# EAGLE board csa_cpu_v2.0g (EAGLE 4.15)
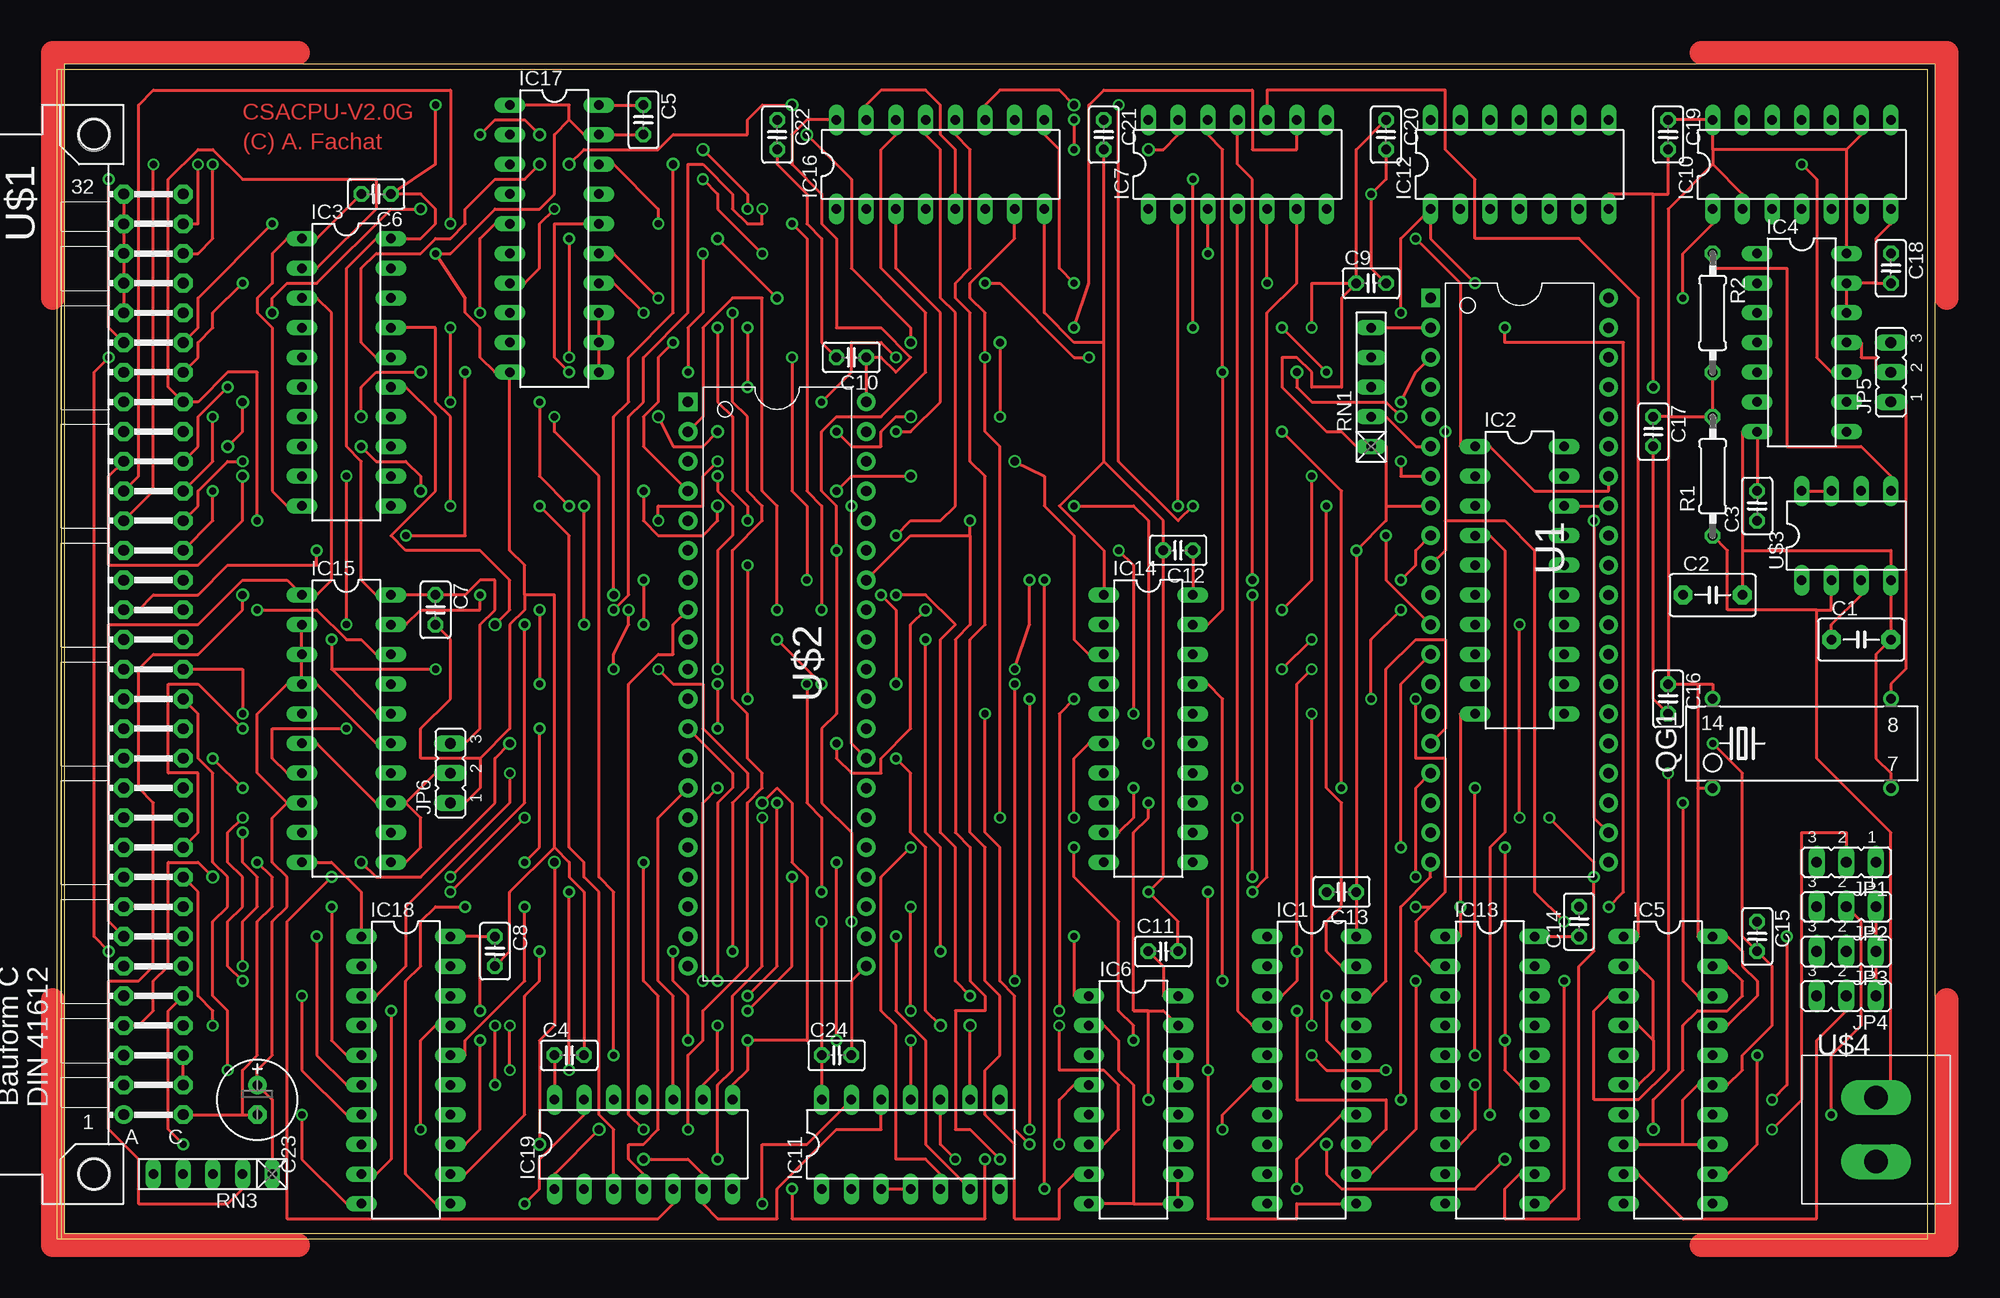
[diagram p2: board, top side]
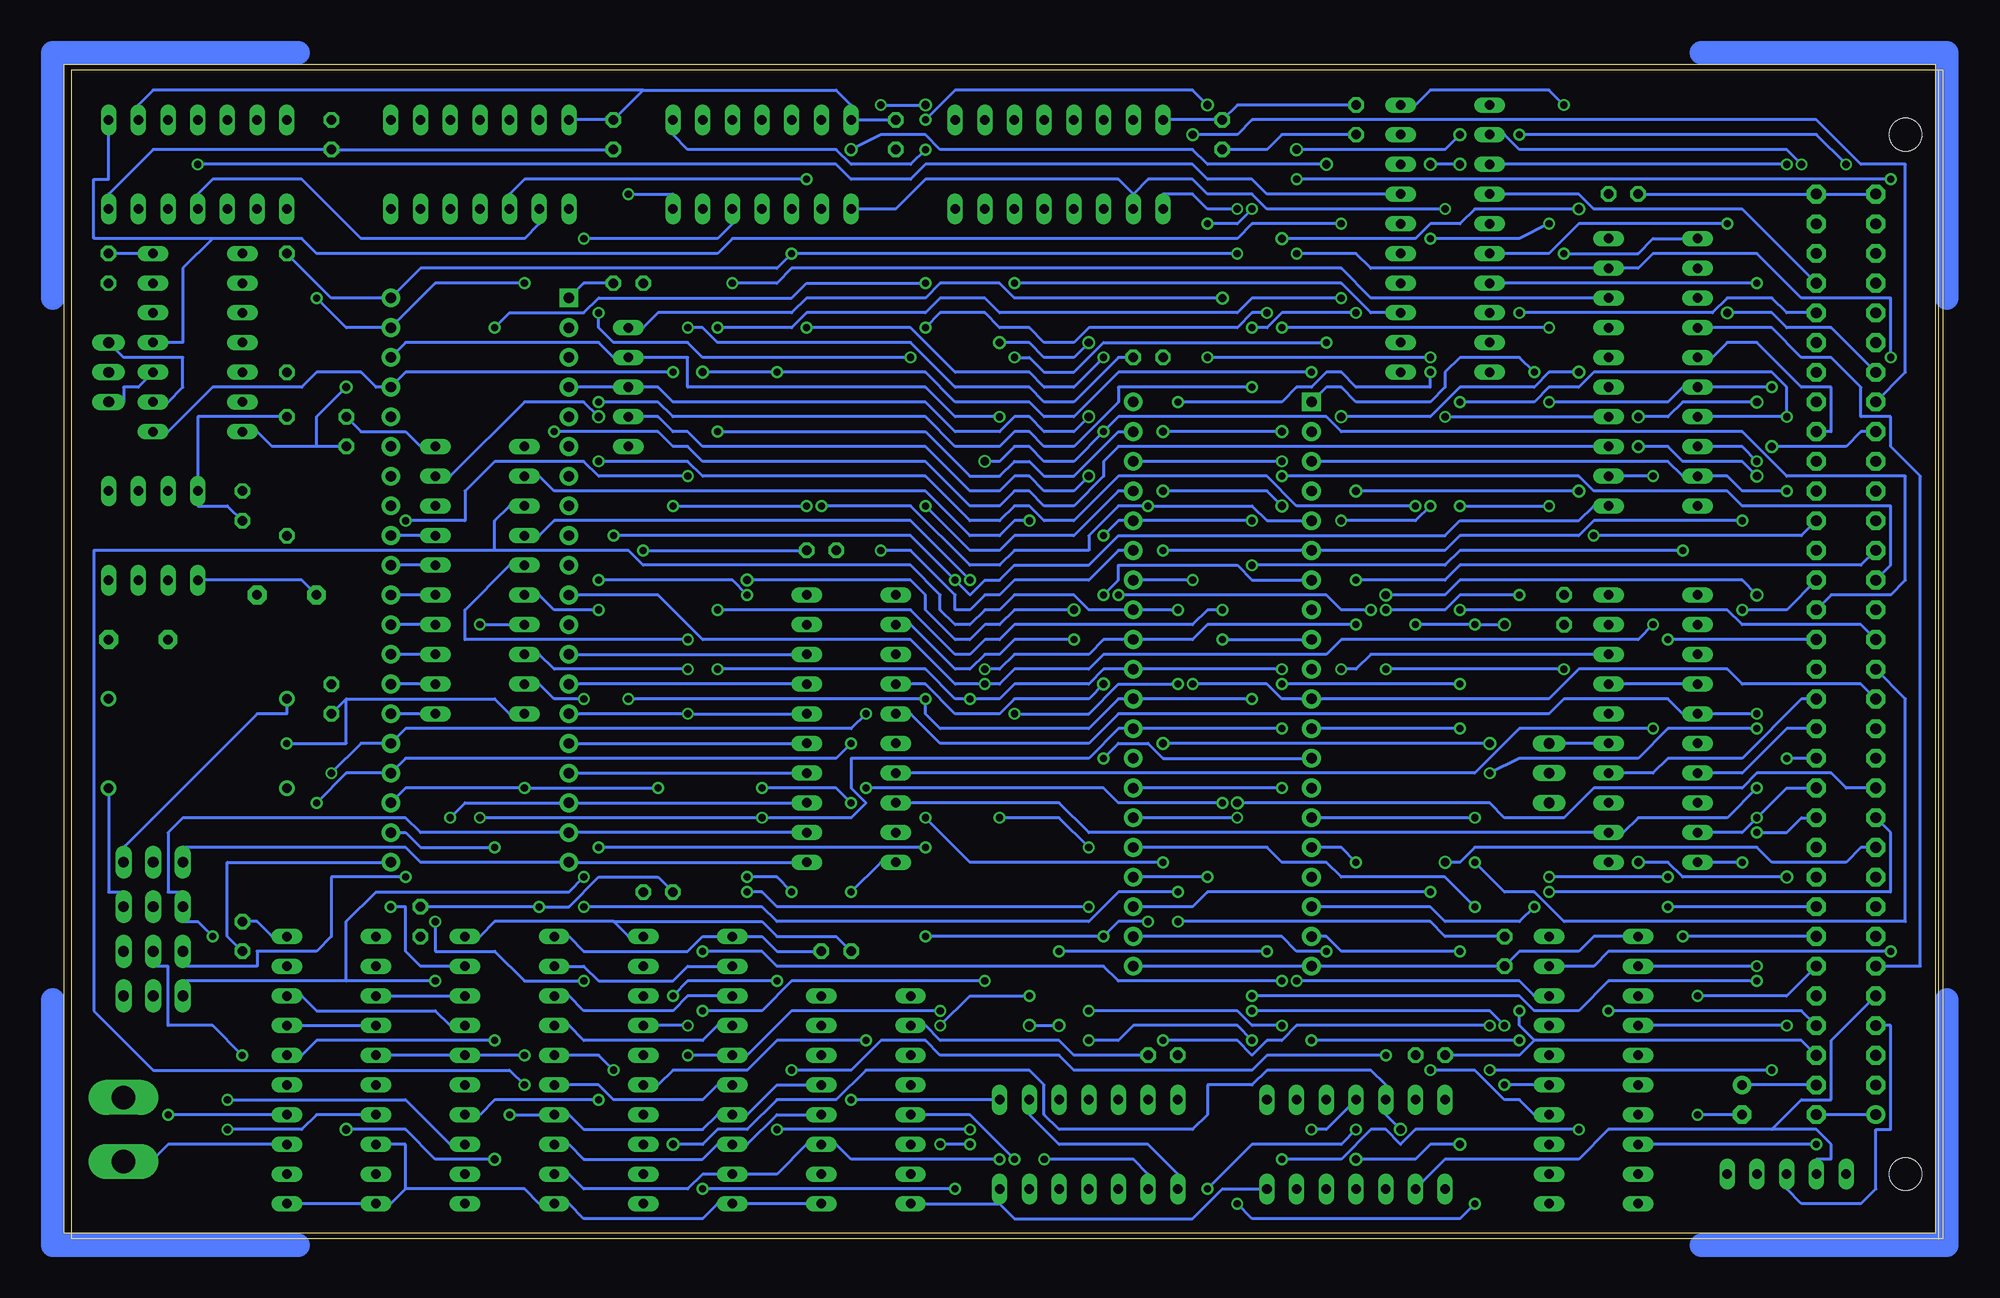
[diagram p3: board, bottom side, seen from below]

Size 160.63 x 100.48 mm. Coordinates in mm from the lower left corner, seen from the top.
Outline: 0,0.01 160,0.01 160,100.01 0,100.01 0,0.01
Outline: 0.63,0.48 160.63,0.48 160.63,100.48 0.63,100.48 0.63,0.48
Copper layers (1*16): Top 0.035mm / dielectric 1.5mm / Bottom 0.035mm
Design rules "default": minimum track width 10mil, minimum drill 24mil, track to track 8mil, track to pad 8mil, pad to pad 8mil, via to via 8mil, smd to smd 8mil, copper to edge 40mil, drill to drill 8mil, minimum pad ring 10mil, minimum via ring 8mil, stop-mask expansion 4mil, vias tented up to drill 0mil, thermal gap 10mil

## Footprints (pad centres in the part's own frame; a part is rotated, then mirrored left to right if it is on the bottom)
C5B3.5 = drill 0.813 pad 1.6 octagon: 1 -2.54,0; 2 2.54,0
C025-025X050 = drill 0.813 octagon: 1 -1.27,0; 2 1.27,0
E2,5-7 = drill 0.813 pad 1.6 round: + -1.27,0 | drill 0.813 pad 1.6 octagon: - 1.27,0
DIL20 = drill 0.813 long: 1 -11.43,-3.81; 2 -8.89,-3.81; 3 -6.35,-3.81; 4 -3.81,-3.81; 5 -1.27,-3.81; 6 1.27,-3.81; 7 3.81,-3.81; 8 6.35,-3.81; 9 8.89,-3.81; 10 11.43,-3.81; 11 11.43,3.81; 12 8.89,3.81; 13 6.35,3.81; 14 3.81,3.81; 15 1.27,3.81; 16 -1.27,3.81; 17 -3.81,3.81; 18 -6.35,3.81; 19 -8.89,3.81; 20 -11.43,3.81
DIL14 = drill 0.813 long: 1 -7.62,-3.81; 2 -5.08,-3.81; 3 -2.54,-3.81; 4 0,-3.81; 5 2.54,-3.81; 6 5.08,-3.81; 7 7.62,-3.81; 8 7.62,3.81; 9 5.08,3.81; 10 2.54,3.81; 11 0,3.81; 12 -2.54,3.81; 13 -5.08,3.81; 14 -7.62,3.81
DIL16 = drill 0.813 long: 1 -8.89,-3.81; 2 -6.35,-3.81; 3 -3.81,-3.81; 4 -1.27,-3.81; 5 1.27,-3.81; 6 3.81,-3.81; 7 6.35,-3.81; 8 8.89,-3.81; 9 8.89,3.81; 10 6.35,3.81; 11 3.81,3.81; 12 1.27,3.81; 13 -1.27,3.81; 14 -3.81,3.81; 15 -6.35,3.81; 16 -8.89,3.81
JP2 = drill 0.914 long: 1 -2.54,0; 2 0,0; 3 2.54,0
SG51 = drill 0.813 round: 1 -7.62,-3.81; 7 7.62,-3.81; 8 7.62,3.81; 14 -7.62,3.81
0207/10 = drill 0.813 octagon: 1 -5.08,0; 2 5.08,0
RN-5 = drill 0.813 long: 1 -5.08,0; 2 -2.54,0; 3 0,0; 4 2.54,0; 5 5.08,0
DIP-40 = drill 0.889 pad 1.6 square: 1 -22.86,-7.62 | drill 0.889 pad 1.6 round: 2 -20.32,-7.62; 3 -17.78,-7.62; 4 -15.24,-7.62; 5 -12.7,-7.62; 6 -10.16,-7.62; 7 -7.62,-7.62; 8 -5.08,-7.62; 9 -2.54,-7.62; 10 0,-7.62; 11 2.54,-7.62; 12 5.08,-7.62; 13 7.62,-7.62; 14 10.16,-7.62; 15 12.7,-7.62; 16 15.24,-7.62; 17 17.78,-7.62; 18 20.32,-7.62; 19 22.86,-7.62; 20 25.4,-7.62; 21 25.4,7.62; 22 22.86,7.62; 23 20.32,7.62; 24 17.78,7.62; 25 15.24,7.62; 26 12.7,7.62; 27 10.16,7.62; 28 7.62,7.62; 29 5.08,7.62; 30 2.54,7.62; 31 0,7.62; 32 -2.54,7.62; 33 -5.08,7.62; 34 -7.62,7.62; 35 -10.16,7.62; 36 -12.7,7.62; 37 -15.24,7.62; 38 -17.78,7.62; 39 -20.32,7.62; 40 -22.86,7.62
CSABUS = drill 0.914 pad 1.6 round: A1 7.62,36.83 | drill 0.914 pad 1.6 octagon: A2 7.62,34.29; A3 7.62,31.75; A4 7.62,29.21; A5 7.62,26.67; A6 7.62,24.13; A7 7.62,21.59; A8 7.62,19.05; A9 7.62,16.51; A10 7.62,13.97; A11 7.62,11.43; A12 7.62,8.89; A13 7.62,6.35; A14 7.62,3.81; A15 7.62,1.27; A16 7.62,-1.27; A17 7.62,-3.81; A18 7.62,-6.35; A19 7.62,-8.89; A20 7.62,-11.43; A21 7.62,-13.97; A22 7.62,-16.51; A23 7.62,-19.05; A24 7.62,-21.59; A25 7.62,-24.13; A26 7.62,-26.67; A27 7.62,-29.21; A28 7.62,-31.75; A29 7.62,-34.29; A30 7.62,-36.83; A31 7.62,-39.37; A32 7.62,-41.91; C1 2.54,36.83; C2 2.54,34.29; C3 2.54,31.75; C4 2.54,29.21; C5 2.54,26.67; C6 2.54,24.13; C7 2.54,21.59; C8 2.54,19.05; C9 2.54,16.51; C10 2.54,13.97; C11 2.54,11.43; C12 2.54,8.89; C13 2.54,6.35; C14 2.54,3.81; C15 2.54,1.27; C16 2.54,-1.27; C17 2.54,-3.81; C18 2.54,-6.35; C19 2.54,-8.89; C20 2.54,-11.43; C21 2.54,-13.97; C22 2.54,-16.51; C23 2.54,-19.05; C24 2.54,-21.59; C25 2.54,-24.13; C26 2.54,-26.67; C27 2.54,-29.21; C28 2.54,-31.75; C29 2.54,-34.29; C30 2.54,-36.83; C31 2.54,-39.37; C32 2.54,-41.91 | hole 2.794: 10.16,41.91; 10.16,-46.99
DIP40 = drill 0.889 pad 1.6 square: 1 -24.13,-7.62 | drill 0.889 pad 1.6 round: 2 -21.59,-7.62; 3 -19.05,-7.62; 4 -16.51,-7.62; 5 -13.97,-7.62; 6 -11.43,-7.62; 7 -8.89,-7.62; 8 -6.35,-7.62; 9 -3.81,-7.62; 10 -1.27,-7.62; 11 1.27,-7.62; 12 3.81,-7.62; 13 6.35,-7.62; 14 8.89,-7.62; 15 11.43,-7.62; 16 13.97,-7.62; 17 16.51,-7.62; 18 19.05,-7.62; 19 21.59,-7.62; 20 24.13,-7.62; 21 24.13,7.62; 22 21.59,7.62; 23 19.05,7.62; 24 16.51,7.62; 25 13.97,7.62; 26 11.43,7.62; 27 8.89,7.62; 28 6.35,7.62; 29 3.81,7.62; 30 1.27,7.62; 31 -1.27,7.62; 32 -3.81,7.62; 33 -6.35,7.62; 34 -8.89,7.62; 35 -11.43,7.62; 36 -13.97,7.62; 37 -16.51,7.62; 38 -19.05,7.62; 39 -21.59,7.62; 40 -24.13,7.62
DIL08@1 = drill 0.813 long: 1 -11.43,-2.54; 2 -8.89,-2.54; 3 -6.35,-2.54; 4 -3.81,-2.54; 5 -3.81,5.08; 6 -6.35,5.08; 7 -8.89,5.08; 8 -11.43,5.08
TASTER = drill 2.007 long: 1 0,4.013; 3 0,-1.473

## Placement (x,y rotation side)
C1  100n  [C5B3.5]  154.3,51.28 0 top
C2  100n  [C5B3.5]  141.6,55.09 0 top
C3  100n  [C025-025X050]  145.41,62.71 90 top
C4  100n  [C025-025X050]  43.81,15.72 0 top
C5  100n  [C025-025X050]  50.16,95.73 270 top
C6  100n  [C025-025X050]  27.3,89.38 180 top
C7  100n  [C025-025X050]  32.38,53.82 270 top
C8  100n  [C025-025X050]  37.46,24.61 270 top
C9  100n  [C025-025X050]  112.39,81.76 0 top
C10  100n  [C025-025X050]  67.94,75.41 180 top
C11  100n  [C025-025X050]  94.61,24.61 0 top
C12  100n  [C025-025X050]  95.88,58.9 180 top
C13  100n  [C025-025X050]  109.85,29.69 180 top
C14  100n  [C025-025X050]  130.17,27.15 90 top
C15  100n  [C025-025X050]  145.41,25.88 270 top
C16  100n  [C025-025X050]  137.79,46.2 270 top
C17  100n  [C025-025X050]  136.52,69.06 270 top
C18  100n  [C025-025X050]  156.84,83.03 270 top
C19  100n  [C025-025X050]  137.79,94.46 270 top
C20  100n  [C025-025X050]  113.66,94.46 270 top
C21  100n  [C025-025X050]  89.53,94.46 270 top
C22  100n  [C025-025X050]  61.59,94.46 270 top
C23  10u  [E2,5-7]  17.14,11.91 270 top
C24  100n  [C025-025X050]  66.67,15.72 0 top
IC1  74LS245N  [DIL20]  107.31,14.45 270 top
IC2  74LS245N  [DIL20]  125.09,56.36 270 top
IC3  74LS245N  [DIL20]  24.76,74.14 270 top
IC4  74LS293N  [DIL14]  149.22,76.68 270 top
IC5  74LS688N  [DIL20]  137.79,14.45 270 top
IC6  74LS173N  [DIL16]  92.07,11.91 270 top
IC7  74LS14N  [DIL14]  100.96,91.92 0 top
IC10  74LS164N  [DIL14]  149.22,91.92 0 top
IC11  74LS02N  [DIL14]  73.02,8.1 0 top
IC12  74LS86N  [DIL14]  125.09,91.92 0 top
IC13  74LS245N  [DIL20]  122.55,14.45 270 top
IC14  74LS245N  [DIL20]  93.34,43.66 270 top
IC15  74LS688N  [DIL20]  24.76,43.66 270 top
IC16  74LS139N  [DIL16]  75.56,91.92 0 top
IC17  74LS245N  [DIL20]  42.54,85.57 270 top
IC18  74LS245N  [DIL20]  29.84,14.45 270 top
IC19  74ALS08N  [DIL14]  50.16,8.1 0 top
JP1  [JP2]  153.03,32.23 180 top
JP2  [JP2]  153.03,28.42 180 top
JP3  [JP2]  153.03,24.61 180 top
JP4  [JP2]  153.03,20.8 180 top
JP5  [JP2]  156.84,74.14 90 top
JP6  [JP2]  33.65,39.85 90 top
QG1  16MHz  [SG51]  149.22,42.39 0 top
R1  10k  [0207/10]  141.6,65.25 90 top
R2  10k  [0207/10]  141.6,79.22 270 top
RN1  [RN-5]  112.39,72.87 90 top
RN3  [RN-5]  13.33,5.56 180 top
U1  [DIP-40]  125.09,57.63 270 top
U$1  CSABUS  [CSABUS]  13.33,47.47 180 top
U$2  LS610SMALLPADS  [DIP40]  61.59,47.47 270 top
U$3  TL7705  [DIL08@1]  160.65,58.9 0 top
U$4  TASTER  [TASTER]  155.57,8.1 0 top

## Tracks (layer width: path | path; a pad name or v marks a point on that pad's centre or on a via)
2PHI2  (via drill 0.61)
  Top 0.254: v43.81,74.14 42.54,75.41 42.54,86.84 IC17.16 | v65.4,71.6 67.94,74.14 67.94,76.68 70.48,76.68 v71.75,75.41 | v97.15,77.95 v97.15,90.65
  Bottom 0.254: v43.81,74.14 43.81,72.87 50.16,72.87 51.43,74.14 52.7,74.14 53.97,72.87 55.24,72.87 56.51,71.6 v65.4,71.6 | v71.75,75.41 74.29,72.87 76.83,72.87 78.1,74.14 84.45,74.14 88.26,77.95 v97.15,77.95 | v97.15,90.65 121.28,90.65 122.55,89.38 IC12.3
8PHI2  (via drill 0.61)
  Top 0.254: v51.43,86.84 51.43,88.11 47.62,91.92 IC17.18 | JP5.2 155.57,74.14 155.57,75.41 154.3,75.41 154.3,76.68 IC4.11
  Bottom 0.254: v51.43,86.84 59.05,86.84 60.32,85.57 103.5,85.57 104.77,84.3 139.06,84.3 140.33,85.57 147.95,85.57 | 147.95,85.57 150.49,83.03 150.49,76.68 IC4.11 | 147.95,85.57 158.11,85.57 158.11,90.65 156.84,90.65 IC10.8
16M  (via drill 0.61)
  Top 0.254: JP5.1 158.11,71.6 158.11,48.74 156.84,47.47 QG1.8 | v149.22,91.92 150.49,90.65 150.49,75.41 151.76,74.14 IC4.10
  Bottom 0.254: v149.22,91.92 94.61,91.92 93.34,90.65 88.26,90.65 86.99,91.92 64.13,91.92 62.86,90.65 59.05,90.65 57.78,89.38 IC17.17 | IC4.10 154.3,72.87 155.57,72.87 155.57,71.6 JP5.1
/BE  (via drill 0.7)
  Top 0.254: 8.25,28.42 8.25,23.34 6.98,22.07 4.44,22.07 4.44,9.37 6.98,6.83 6.98,3.02 14.6,3.02 15.87,4.29 RN3.2 | 8.25,28.42 U$1.A8 | 8.25,28.42 8.25,37.31 6.98,38.58 6.98,48.74 8.25,50.01 12.06,50.01 15.87,53.82 v15.87,55.09 | v47.62,55.09 47.62,70.33 48.89,71.6 48.89,75.41 52.7,79.22 v52.7,91.92 | IC7.13 95.88,94.46 94.61,93.19 v93.34,93.19
  Bottom 0.254: v15.87,55.09 17.14,56.36 41.27,56.36 42.54,55.09 v47.62,55.09 | v93.34,93.19 90.8,94.46 86.99,94.46 85.72,93.19 64.13,93.19 62.86,91.92 v52.7,91.92
/BEXTIO
  Bottom 0.254: 14.6,9.37 10.79,9.37 9.52,8.1 9.52,6.83 10.79,6.83 RN3.4 | 14.6,9.37 28.57,9.37 31.11,6.83 42.54,6.83 IC19.2 | U$1.A5 9.52,16.99 9.52,11.91 12.06,11.91 14.6,9.37
/BIOINH  (via drill 0.7)
  Top 0.254: U$1.A4 6.98,18.26 8.25,19.53 8.25,22.07 9.52,23.34 9.52,32.23 12.06,32.23 v13.33,30.96 | v26.03,32.23 27.3,30.96 31.11,30.96 37.46,37.31 37.46,41.12 v38.73,42.39 | v66.67,42.39 66.67,41.12 67.94,39.85 70.48,39.85 70.48,41.12 73.02,43.66 73.02,52.55 v74.29,53.82 | v102.23,56.36 102.23,90.65 100.96,91.92 IC7.11
  Bottom 0.254: U$1.A4 4.44,18.26 4.44,9.37 5.71,9.37 5.71,4.29 6.98,3.02 12.06,3.02 13.33,4.29 RN3.3 | v13.33,30.96 22.22,30.96 23.49,32.23 v26.03,32.23 | v38.73,42.39 v66.67,42.39 | v74.29,53.82 79.37,53.82 80.64,52.55 81.91,52.55 83.18,51.28 84.45,51.28 86.99,53.82 86.99,55.09 88.26,56.36 v102.23,56.36
/BIOSEL
  Top 0.254: IC3.3 22.22,80.49 23.49,79.22 23.49,56.36 22.22,55.09 IC15.1 19.68,56.36 15.87,56.36 12.06,52.55 4.44,52.55 4.44,27.15 U$1.A7
/BMEMSEL
  Bottom 0.254: U$1.A6 1.9,23.34 1.9,65.25 4.44,67.79 4.44,70.33 6.98,70.33 6.98,72.87 9.52,75.41 12.06,75.41 14.6,77.95 IC3.4
/BUSEN  (via drill 0.61, 0.7)
  Top 0.254: IC14.19 98.42,52.55 99.69,53.82 v99.69,74.14 99.69,93.19 98.42,94.46 IC7.12 | v4.44,24.61 3.17,25.88 3.17,74.14 v4.44,75.41 | v55.24,84.3 55.24,79.22 53.97,77.95 v53.97,74.14 | v114.93,70.33 113.66,71.6 107.31,71.6 106.04,72.87 v106.04,74.14
  Bottom 0.254: v4.44,24.61 28.57,24.61 29.84,23.34 IC18.19 | v4.44,75.41 4.44,80.49 12.06,80.49 15.87,84.3 24.76,84.3 26.03,83.03 IC3.19 48.89,83.03 50.16,84.3 v55.24,84.3 | v53.97,74.14 70.48,74.14 74.29,70.33 76.83,70.33 78.1,71.6 84.45,71.6 86.99,74.14 v99.69,74.14 v106.04,74.14 | IC2.19 127.63,65.25 121.28,71.6 116.2,71.6 v114.93,70.33
/IOSEL  (via drill 0.61)
  Top 0.254: v33.65,62.71 33.65,70.33 32.38,71.6 32.38,77.95 IC3.17 | v41.27,62.71 43.81,60.17 43.81,33.5 45.08,32.23 45.08,30.96 46.35,29.69 46.35,10.64 47.62,9.37 IC19.3
  Bottom 0.254: v41.27,62.71 v33.65,62.71
/IRQ  (via drill 0.7)
  Top 0.254: v73.02,70.33 71.75,70.33 70.48,69.06 70.48,67.79 67.94,67.79 v66.67,69.06 | v56.51,69.06 55.24,67.79 52.7,67.79 v51.43,70.33 | v31.11,74.14 27.3,74.14 26.03,72.87 v26.03,70.33 | v15.87,71.6 15.87,69.06 v14.6,67.79
  Bottom 0.254: U1.4 RN1.3 109.85,72.87 108.58,71.6 86.99,71.6 84.45,69.06 80.64,69.06 79.37,70.33 78.1,70.33 76.83,69.06 74.29,69.06 v73.02,70.33 | v56.51,69.06 v66.67,69.06 | v51.43,70.33 43.81,70.33 41.27,72.87 34.92,72.87 33.65,74.14 v31.11,74.14 | v26.03,70.33 23.49,70.33 22.22,71.6 v15.87,71.6 | v14.6,67.79 8.25,67.79 6.98,69.06 U$1.A24
/MMUCS  (via drill 0.61)
  Top 0.254: v73.02,33.5 70.48,30.96 70.48,19.53 71.75,18.26 71.75,6.83 74.29,6.83 75.56,5.56 IC11.5 | v80.64,36.04 80.64,67.79 79.37,69.06 v79.37,75.41 79.37,79.22 78.1,80.49 78.1,81.76 81.91,85.57 IC16.7 | v52.7,76.68 51.43,75.41 51.43,71.6 50.16,70.33 50.16,67.79 U$2.4
  Bottom 0.254: v73.02,33.5 75.56,36.04 v80.64,36.04 | v79.37,75.41 78.1,75.41 76.83,74.14 74.29,74.14 71.75,76.68 v52.7,76.68
/MMUSTROBE  (via drill 0.61)
  Top 0.254: v95.88,62.71 IC7.2 | U$2.28 67.94,42.39 v67.94,62.71
  Bottom 0.254: v95.88,62.71 88.26,62.71 83.18,57.63 80.64,57.63 79.37,58.9 73.02,58.9 73.02,60.17 70.48,62.71 v67.94,62.71 59.05,62.71 57.78,61.44 U$2.5
/NMI  (via drill 0.7)
  Top 0.254: U1.6 116.2,67.79 113.66,70.33 RN1.2 | v73.02,65.25 67.94,65.25 v66.67,63.98 | v56.51,62.71 56.51,61.44 55.24,60.17 51.43,60.17 50.16,61.44 v50.16,63.98 | v31.11,63.98 31.11,65.25 29.84,66.52 27.3,66.52 v26.03,67.79 | v15.87,65.25 15.87,61.44 12.06,57.63 4.44,57.63 4.44,65.25 U$1.A23
  Bottom 0.254: RN1.2 109.85,70.33 108.58,69.06 107.31,69.06 106.04,67.79 86.99,67.79 83.18,63.98 80.64,63.98 79.37,65.25 78.1,65.25 76.83,63.98 74.29,63.98 v73.02,65.25 | v66.67,63.98 57.78,63.98 v56.51,62.71 | v31.11,63.98 v50.16,63.98 | v26.03,67.79 23.49,67.79 22.22,66.52 17.14,66.52 v15.87,65.25
/PMEMSEL  (via drill 0.61, 0.7)
  Top 0.254: IC3.16 27.3,75.41 26.03,76.68 26.03,83.03 27.3,84.3 31.11,84.3 32.38,85.57 33.65,85.57 34.92,86.84 34.92,88.11 37.46,90.65 40,90.65 v41.27,91.92 | v43.81,91.92 45.08,93.19 51.43,93.19 52.7,94.46 59.05,94.46 59.05,95.73 60.32,97 v62.86,97 | v86.99,95.73 v86.99,93.19
  Bottom 0.254: v41.27,91.92 v43.81,91.92 | v62.86,97 64.13,98.27 84.45,98.27 v86.99,95.73 | v86.99,93.19 88.26,91.92 93.34,91.92 94.61,93.19 107.31,93.19 108.58,94.46 IC7.8
/RES  (via drill 0.61)
  Top 0.254: v98.42,84.3 IC7.3 | R2.1 141.6,83.03 147.95,83.03 147.95,67.79 154.3,67.79 156.84,65.25 U$3.5 | U$1.A27 4.44,77.95 v4.44,90.65 | v55.24,90.65 56.51,89.38 56.51,88.11 v60.32,84.3
  Bottom 0.254: R2.1 137.79,80.49 U1.40 130.17,83.03 99.69,83.03 v98.42,84.3 v60.32,84.3 | v4.44,90.65 v55.24,90.65
/SO  (via drill 0.61, 0.7)
  Top 0.254: v64.13,94.46 67.94,90.65 67.94,83.03 73.02,77.95 v73.02,76.68 | v80.64,76.68 v80.64,70.33
  Bottom 0.254: U1.38 131.44,76.68 114.93,76.68 113.66,75.41 RN1.4 107.31,75.41 107.31,72.87 86.99,72.87 84.45,70.33 v80.64,70.33 | U$1.A25 3.17,74.14 3.17,91.92 6.98,91.92 10.79,95.73 59.05,95.73 60.32,94.46 v64.13,94.46 | v73.02,76.68 74.29,75.41 76.83,75.41 78.1,76.68 v80.64,76.68
A0  (via drill 0.61)
  Top 0.254: v98.42,29.69 v98.42,14.45 98.42,1.75 106.04,1.75 106.04,3.02 IC1.11 | v102.23,30.96 v102.23,55.09 | v114.93,56.36 116.2,57.63 116.2,58.9 U1.9 | v42.54,70.33 42.54,69.06 46.35,65.25 46.35,30.96 47.62,29.69 v47.62,15.72
  Bottom 0.254: v98.42,29.69 99.69,30.96 v102.23,30.96 | v102.23,55.09 103.5,56.36 v114.93,56.36 | v47.62,15.72 57.78,15.72 59.05,14.45 74.29,14.45 75.56,15.72 85.72,15.72 86.99,16.99 90.8,16.99 93.34,14.45 v98.42,14.45 | v42.54,70.33 IC3.14
A1  (via drill 0.61)
  Top 0.254: v116.2,22.07 116.2,9.37 112.39,5.56 IC1.12 | v128.9,27.15 126.36,29.69 126.36,58.9 123.82,61.44 118.74,61.44 | 118.74,61.44 118.74,58.9 U1.10 | v118.74,69.06 118.74,61.44
  Bottom 0.254: v116.2,22.07 121.28,22.07 123.82,24.61 128.9,24.61 v128.9,27.15 | v118.74,69.06 109.85,69.06 108.58,67.79 107.31,67.79 106.04,66.52 86.99,66.52 83.18,62.71 80.64,62.71 79.37,63.98 78.1,63.98 76.83,62.71 74.29,62.71 71.75,65.25 71.75,66.52 70.48,67.79 IC3.13
A2  (via drill 0.61)
  Top 0.254: v24.76,52.55 v24.76,65.25 | v106.04,19.53 106.04,11.91 113.66,11.91 113.66,9.37 112.39,8.1 IC1.13 | v81.91,47.47 v81.91,22.07
  Bottom 0.254: v24.76,52.55 26.03,51.28 51.43,51.28 52.7,50.01 71.75,50.01 73.02,48.74 79.37,48.74 80.64,47.47 v81.91,47.47 84.45,47.47 88.26,51.28 106.04,51.28 109.85,55.09 U1.11 | v24.76,65.25 IC3.12 | v106.04,19.53 100.96,19.53 98.42,22.07 v81.91,22.07
A3  (via drill 0.61)
  Top 0.254: v113.66,60.17 113.66,56.36 U1.12 | v106.04,4.29 106.04,6.83 109.85,10.64 IC1.14 | v84.45,4.29 v84.45,56.36
  Bottom 0.254: v113.66,60.17 88.26,60.17 v84.45,56.36 83.18,55.09 81.91,56.36 80.64,56.36 79.37,57.63 73.02,57.63 70.48,60.17 42.54,60.17 41.27,61.44 31.11,61.44 29.84,62.71 IC3.11 | v84.45,4.29 v106.04,4.29
A4  (via drill 0.61)
  Top 0.254: v92.07,16.99 92.07,18.26 90.8,19.53 90.8,27.15 86.99,30.96 v86.99,33.5 | v114.93,33.5 114.93,47.47 U1.13
  Bottom 0.254: U1.13 IC14.18 | v92.07,16.99 99.69,16.99 102.23,14.45 108.58,14.45 109.85,13.18 IC1.15 | v86.99,33.5 v114.93,33.5
A5  (via drill 0.61)
  Top 0.254: v108.58,20.8 108.58,16.99 109.85,15.72 IC1.16 | v99.69,22.07 99.69,46.2 98.42,47.47 IC14.17
  Bottom 0.254: v108.58,20.8 107.31,22.07 v99.69,22.07 | IC14.17 U1.14
A6  (via drill 0.61)
  Top 0.254: v107.31,18.26 v107.31,44.93
  Bottom 0.254: v107.31,18.26 IC1.17 | IC14.16 v107.31,44.93 U1.15
A7
  Top 0.254: U1.16 118.74,43.66 118.74,51.28 116.2,51.28 113.66,48.74 113.66,22.07 112.39,20.8 IC1.18
  Bottom 0.254: U1.16 IC14.15
A8  (via drill 0.61)
  Top 0.254: v128.9,22.07 128.9,4.29 127.63,3.02 IC13.11 | U1.17 116.2,38.58 v116.2,30.96
  Bottom 0.254: U1.17 IC14.14 | 136.52,22.07 150.49,22.07 JP4.3 | v128.9,22.07 136.52,22.07 | v116.2,30.96 117.47,29.69 133.98,29.69 136.52,27.15 136.52,22.07
A9  (via drill 0.61)
  Top 0.254: v127.63,36.04 131.44,32.23 v131.44,30.96 131.44,24.61 130.17,23.34 130.17,1.75 123.82,1.75 123.82,4.29 125.09,5.56 IC13.12
  Bottom 0.254: v127.63,36.04 126.36,37.31 U1.18 IC14.13 | v131.44,30.96 137.79,30.96 137.79,25.88 139.06,24.61 144.14,24.61 144.14,23.34 150.49,23.34 JP3.3
A10  (via drill 0.61)
  Top 0.254: v146.68,11.91 147.95,13.18 v147.95,25.88
  Bottom 0.254: IC14.12 U1.19 130.17,34.77 131.44,36.04 150.49,36.04 151.76,34.77 151.76,29.69 150.49,29.69 JP2.3 150.49,27.15 149.22,27.15 v147.95,25.88 | v146.68,11.91 131.44,11.91 127.63,8.1 IC13.13
A11  (via drill 0.61)
  Top 0.254: v114.93,11.91 114.93,28.42 117.47,30.96 U1.20
  Bottom 0.254: v114.93,11.91 123.82,11.91 125.09,10.64 IC13.14 | IC14.11 U1.20 130.17,32.23 131.44,33.5 150.49,33.5 JP1.3
B2PHI2
  Bottom 0.254: U$1.C29 17.14,88.11 29.84,88.11 31.11,89.38 IC17.4
B8PHI2  (via drill 0.61)
  Top 0.254: U$1.C31 12.06,86.84 v12.06,91.92
  Bottom 0.254: v12.06,91.92 13.33,93.19 36.19,93.19 37.46,94.46 IC17.2
B16M  (via drill 0.61)
  Top 0.254: U$1.C30 12.06,84.3 13.33,85.57 v13.33,91.92
  Bottom 0.254: v13.33,91.92 IC17.3
BPHI0  (via drill 0.61)
  Top 0.254: v36.19,79.22 36.19,85.57 37.46,86.84 IC17.5
  Bottom 0.254: U$1.C28 13.33,79.22 14.6,80.49 18.41,80.49 19.68,79.22 v36.19,79.22
BPHI1  (via drill 0.61)
  Top 0.254: v18.41,86.84 12.06,80.49 12.06,77.95 U$1.C27
  Bottom 0.254: v18.41,86.84 31.11,86.84 33.65,84.3 IC17.6
BPHI2  (via drill 0.61)
  Top 0.254: v15.87,81.76 13.33,79.22 13.33,77.95 12.06,76.68 12.06,75.41 U$1.C26 | v42.54,88.11 41.27,86.84 41.27,83.03 40,81.76 IC17.7
  Bottom 0.254: 69.21,89.38 70.48,90.65 86.99,90.65 89.53,88.11 IC7.1 | v15.87,81.76 IC17.7 | 69.21,89.38 67.94,90.65 64.13,90.65 62.86,89.38 59.05,89.38 57.78,88.11 v42.54,88.11 | 69.21,89.38 IC16.2
BR/W  (via drill 0.61)
  Top 0.254: IC3.2 22.22,83.03 27.3,88.11 27.3,90.65 15.87,90.65 13.33,93.19 12.06,93.19 9.52,90.65 9.52,72.87 U$1.C25 12.06,71.6 14.6,74.14 17.14,74.14 v17.14,61.44 | v86.99,25.88 86.99,20.8 IC6.1 | IC16.14 71.75,94.46 70.48,93.19 70.48,83.03 74.29,79.22 74.29,74.14 70.48,70.33 66.67,70.33 65.4,69.06 65.4,63.98 66.67,62.71 v66.67,58.9 66.67,44.93 65.4,43.66 65.4,37.31 67.94,34.77 v67.94,27.15 | v71.75,25.88 71.75,19.53 74.29,16.99 74.29,8.1 IC11.6
  Bottom 0.254: v86.99,25.88 v71.75,25.88 70.48,27.15 v67.94,27.15 | v66.67,58.9 U$2.6 42.54,58.9 41.27,60.17 31.11,60.17 29.84,61.44 v17.14,61.44
BSYNC
  Bottom 0.254: U$1.C24 9.52,69.06 9.52,72.87 12.06,72.87 15.87,76.68 18.41,76.68 19.68,75.41 IC3.5
BUSA0  (via drill 0.61)
  Top 0.254: v14.6,72.87 12.06,70.33 12.06,67.79 U$1.C23 | v71.75,60.17 73.02,61.44 75.56,61.44 76.83,62.71 76.83,79.22 75.56,80.49 75.56,93.19 74.29,94.46 IC16.13 | v33.65,71.6 v33.65,77.95 | v56.51,77.95 56.51,71.6 57.78,70.33 57.78,63.98 59.05,62.71 v59.05,61.44
  Bottom 0.254: v14.6,72.87 IC3.6 22.22,72.87 23.49,71.6 v33.65,71.6 | v71.75,60.17 70.48,61.44 U$2.36 v59.05,61.44 | v33.65,77.95 v56.51,77.95
BUSA1  (via drill 0.61)
  Top 0.254: v56.51,66.52 55.24,65.25 55.24,62.71 51.43,62.71 v51.43,61.44 | v41.27,71.6 41.27,65.25 v43.81,62.71 | U$1.C22 13.33,66.52 v13.33,70.33
  Bottom 0.254: IC3.7 v13.33,70.33 13.33,72.87 14.6,74.14 29.84,74.14 31.11,72.87 33.65,72.87 34.92,71.6 v41.27,71.6 | v56.51,66.52 U$2.38 | v43.81,62.71 45.08,61.44 v51.43,61.44
BUSA2  (via drill 0.61)
  Top 0.254: v15.87,66.52 14.6,66.52 12.06,63.98 12.06,62.71 U$1.C21 | v29.84,60.17 34.92,60.17 v34.92,74.14
  Bottom 0.254: v15.87,66.52 17.14,67.79 IC3.8 | U$2.1 52.7,72.87 51.43,72.87 50.16,71.6 43.81,71.6 42.54,72.87 42.54,74.14 41.27,75.41 36.19,75.41 v34.92,74.14 | v29.84,60.17 12.06,60.17 U$1.C21
BUSA3  (via drill 0.61)
  Top 0.254: U$1.C20 13.33,61.44 v13.33,63.98
  Bottom 0.254: U$2.3 23.49,66.52 22.22,65.25 IC3.9 18.41,65.25 17.14,63.98 v13.33,63.98
BUSA4  (via drill 0.61)
  Top 0.254: v17.14,53.82 22.22,53.82 24.76,51.28 26.03,51.28 27.3,50.01 IC15.18 | v75.56,24.61 75.56,33.5 74.29,34.77 v74.29,51.28 | v51.43,48.74 52.7,47.47 55.24,47.47 55.24,43.66 59.05,39.85 59.05,38.58 57.78,37.31 v57.78,24.61
  Bottom 0.254: v17.14,53.82 13.33,53.82 U$1.C19 | v57.78,24.61 v75.56,24.61 | v74.29,51.28 79.37,51.28 80.64,50.01 81.91,50.01 83.18,48.74 84.45,48.74 88.26,52.55 IC14.2 | IC15.18 48.89,50.01 50.16,48.74 v51.43,48.74
BUSA5  (via drill 0.61, 0.7)
  Top 0.254: IC14.3 88.26,50.01 86.99,51.28 86.99,60.17 84.45,62.71 84.45,65.25 v81.91,66.52 | v71.75,69.06 73.02,69.06 75.56,71.6 75.56,79.22 71.75,83.03 IC16.3
  Bottom 0.254: U$1.C18 9.52,55.09 4.44,55.09 3.17,56.36 3.17,65.25 13.33,65.25 17.14,69.06 51.43,69.06 52.7,70.33 70.48,70.33 v71.75,69.06 74.29,66.52 76.83,66.52 78.1,67.79 79.37,67.79 80.64,66.52 v81.91,66.52
BUSA6  (via drill 0.61, 0.7)
  Top 0.254: 23.49,48.74 27.3,44.93 IC15.16 | v23.49,51.28 23.49,48.74 | v48.89,53.82 48.89,52.55 47.62,50.01 v47.62,48.74 | 23.49,48.74 v32.38,48.74 | v70.48,55.09 71.75,53.82 v71.75,47.47
  Bottom 0.254: U$1.C17 v23.49,51.28 | v48.89,53.82 51.43,53.82 52.7,55.09 v70.48,55.09 | v32.38,48.74 v47.62,48.74 | v71.75,47.47 73.02,46.2 79.37,46.2 80.64,44.93 84.45,44.93 86.99,47.47 IC14.4
BUSA7  (via drill 0.61)
  Top 0.254: U$1.C16 15.87,48.74 v15.87,44.93
  Bottom 0.254: IC14.5 88.26,44.93 85.72,42.39 73.02,42.39 70.48,44.93 33.65,44.93 32.38,46.2 23.49,46.2 22.22,44.93 IC15.5 v15.87,44.93
BUSA8  (via drill 0.61)
  Top 0.254: v86.99,36.04 86.99,41.12 88.26,42.39 IC14.6 | v66.67,16.99 v66.67,32.23 | v38.73,14.45 v38.73,18.26 | v14.6,14.45 14.6,19.53 13.33,20.8 13.33,27.15 14.6,28.42 14.6,30.96 13.33,32.23 13.33,39.85 12.06,41.12 12.06,44.93 U$1.C15
  Bottom 0.254: U$1.C15 12.06,46.2 17.14,41.12 23.49,41.12 24.76,39.85 IC15.14 | v86.99,36.04 83.18,32.23 v66.67,32.23 | v66.67,16.99 60.32,16.99 59.05,15.72 57.78,16.99 56.51,16.99 55.24,18.26 v38.73,18.26 | v14.6,14.45 v38.73,14.45
BUSA9  (via drill 0.61)
  Top 0.254: v24.76,43.66 18.41,43.66 18.41,41.12 19.68,39.85 IC15.7
  Bottom 0.254: U$1.C14 13.33,43.66 17.14,39.85 IC15.7 | v24.76,43.66 36.19,43.66 40,39.85 IC14.7
BUSA10  (via drill 0.61)
  Top 0.254: v13.33,41.12 v15.87,38.58
  Bottom 0.254: IC14.8 75.56,37.31 73.02,34.77 IC15.12 27.3,34.77 26.03,36.04 18.41,36.04 v15.87,38.58 | U$1.C13 v13.33,41.12
BUSA11  (via drill 0.61)
  Top 0.254: v92.07,38.58 92.07,36.04 90.8,34.77 IC14.9 | v61.59,37.31 61.59,23.34 v59.05,20.8 | v15.87,22.07 14.6,23.34 14.6,27.15 15.87,28.42 15.87,30.96 14.6,32.23 14.6,34.77 v15.87,36.04
  Bottom 0.254: U$1.C12 13.33,38.58 v15.87,36.04 17.14,34.77 IC15.9 | v92.07,38.58 71.75,38.58 70.48,37.31 v61.59,37.31 | v59.05,20.8 36.19,20.8 34.92,19.53 31.11,19.53 28.57,22.07 v15.87,22.07
BUSA12  (via drill 0.61)
  Top 0.254: v15.87,23.34 15.87,27.15 17.14,28.42 17.14,30.96 15.87,32.23 v15.87,34.77
  Bottom 0.254: v15.87,34.77 13.33,34.77 12.06,36.04 U$1.C11 | v15.87,23.34 IC18.2
BUSA13  (via drill 0.61)
  Top 0.254: v38.73,39.85 38.73,37.31 29.84,28.42 29.84,23.34 27.3,20.8 IC18.3 | v15.87,43.66 12.06,47.47 9.52,47.47 9.52,39.85 12.06,39.85 12.06,34.77 U$1.C10
  Bottom 0.254: v38.73,39.85 36.19,41.12 26.03,41.12 23.49,43.66 v15.87,43.66
BUSA14  (via drill 0.61)
  Top 0.254: v13.33,18.26 13.33,19.53 12.06,20.8 12.06,29.69 U$1.C9
  Bottom 0.254: v13.33,18.26 IC18.4
BUSA15  (via drill 0.61)
  Top 0.254: v23.49,28.42 23.49,16.99 24.76,15.72 IC18.5
  Bottom 0.254: U$1.C8 v23.49,28.42
BUSA16  (via drill 0.61)
  Top 0.254: v22.22,25.88 22.22,15.72 24.76,13.18 IC18.6
  Bottom 0.254: U$1.C7 v22.22,25.88
BUSA17  (via drill 0.61)
  Top 0.254: v20.95,20.8 20.95,14.45 24.76,10.64 IC18.7
  Bottom 0.254: v20.95,20.8 13.33,20.8 U$1.C6
BUSA18  (via drill 0.61)
  Top 0.254: v10.79,8.1 9.52,9.37 9.52,19.53 U$1.C5
  Bottom 0.254: v10.79,8.1 IC18.8
BUSA19  (via drill 0.61)
  Top 0.254: v28.57,19.53 28.57,6.83 27.3,5.56 IC18.9
  Bottom 0.254: v28.57,19.53 12.06,19.53 U$1.C4
BUSD0  (via drill 0.61)
  Top 0.254: 78.1,60.17 v78.1,61.44 | 78.1,60.17 73.02,60.17 U$2.34 | U$1.A22 6.98,65.25 6.98,97 8.25,98.27 33.65,98.27 v33.65,86.84 | v43.81,85.57 v43.81,75.41 | v62.86,75.41 62.86,63.98 64.13,62.71 v64.13,56.36 | v80.64,6.83 78.1,9.37 76.83,9.37 76.83,19.53 79.37,19.53 79.37,20.8 78.1,22.07 78.1,33.5 76.83,34.77 76.83,51.28 78.1,52.55 78.1,60.17
  Bottom 0.254: IC13.9 117.47,5.56 116.2,4.29 107.31,4.29 106.04,5.56 IC1.9 99.69,5.56 97.15,8.1 IC6.11 94.61,8.1 93.34,6.83 v80.64,6.83 | v78.1,61.44 79.37,61.44 80.64,60.17 83.18,60.17 86.99,63.98 118.74,63.98 120.01,65.25 IC2.2 | v33.65,86.84 36.19,85.57 v43.81,85.57 | v43.81,75.41 v62.86,75.41 | v64.13,56.36 U$2.34
BUSD1  (via drill 0.61, 0.7)
  Top 0.254: U$1.A21 8.25,63.98 v8.25,91.92 | v59.05,88.11 59.05,89.38 v55.24,93.19 | v62.86,86.84 64.13,85.57 64.13,63.98 65.4,62.71 v65.4,53.82 | v121.28,13.18 121.28,9.37 120.01,8.1 IC13.8 | v36.19,94.46 37.46,95.73 40,95.73 v41.27,94.46
  Bottom 0.254: IC6.12 99.69,10.64 102.23,8.1 IC1.8 104.77,8.1 106.04,6.83 116.2,6.83 117.47,8.1 IC13.8 | 123.82,58.9 123.82,61.44 122.55,62.71 IC2.3 | 123.82,58.9 112.39,58.9 111.12,57.63 88.26,57.63 85.72,55.09 85.72,53.82 84.45,52.55 83.18,52.55 81.91,53.82 80.64,53.82 79.37,55.09 74.29,55.09 73.02,53.82 U$2.33 v65.4,53.82 | v8.25,91.92 10.79,94.46 v36.19,94.46 | v59.05,88.11 60.32,86.84 v62.86,86.84 | v121.28,13.18 122.55,14.45 153.03,14.45 158.11,19.53 158.11,58.9 123.82,58.9 | v41.27,94.46 42.54,93.19 v55.24,93.19
BUSD2  (via drill 0.61)
  Top 0.254: IC6.13 IC6.14 | v122.55,10.64 122.55,33.5 123.82,34.77 123.82,58.9 122.55,60.17 IC2.4 | v81.91,48.74 83.18,52.55 v83.18,56.36 | v50.16,56.36 v50.16,52.55
  Bottom 0.254: IC6.13 99.69,13.18 102.23,10.64 IC1.7 104.77,10.64 106.04,9.37 116.2,9.37 117.47,10.64 IC13.7 v122.55,10.64 | v81.91,48.74 80.64,48.74 79.37,50.01 73.02,50.01 71.75,51.28 U$2.32 64.13,51.28 62.86,52.55 v50.16,52.55 | v83.18,56.36 88.26,61.44 118.74,61.44 120.01,60.17 IC2.4 | U$1.A20 6.98,57.63 41.27,57.63 42.54,56.36 v50.16,56.36
BUSD3  (via drill 0.61)
  Top 0.254: v104.77,48.74 v107.31,51.28 | v56.51,65.25 56.51,63.98 57.78,62.71 57.78,60.17 56.51,58.9 v56.51,48.74 | v99.69,9.37 99.69,10.64 102.23,13.18 IC1.6 | v83.18,46.2 v83.18,9.37
  Bottom 0.254: IC1.6 104.77,13.18 106.04,11.91 113.66,11.91 114.93,13.18 IC13.6 | v107.31,51.28 126.36,51.28 126.36,53.82 122.55,57.63 IC2.5 | v104.77,48.74 86.99,48.74 84.45,46.2 v83.18,46.2 80.64,46.2 79.37,47.47 73.02,47.47 71.75,48.74 U$2.31 v56.51,48.74 | U$1.A19 4.44,57.63 4.44,62.71 17.14,62.71 18.41,63.98 29.84,63.98 31.11,65.25 v56.51,65.25 | v83.18,9.37 v99.69,9.37
BUSD4  (via drill 0.61)
  Top 0.254: v107.31,15.72 108.58,14.45 v113.66,14.45 | v114.93,53.82 112.39,51.28 v112.39,46.2 | U$1.A18 6.98,53.82 8.25,55.09 12.06,55.09 14.6,57.63 22.22,57.63 v22.22,58.9 | v59.05,57.63 v59.05,46.2 | v86.99,46.2 85.72,44.93 v85.72,19.53
  Bottom 0.254: v113.66,14.45 114.93,15.72 IC13.5 | v107.31,15.72 IC1.5 102.23,15.72 98.42,19.53 v85.72,19.53 | v114.93,53.82 118.74,53.82 120.01,55.09 IC2.6 | v112.39,46.2 v86.99,46.2 86.99,44.93 85.72,43.66 73.02,43.66 70.48,46.2 U$2.30 v59.05,46.2 | v22.22,58.9 41.27,58.9 42.54,57.63 v59.05,57.63
BUSD5  (via drill 0.61)
  Top 0.254: v125.09,36.04 v125.09,52.55 | v100.96,36.04 100.96,19.53 102.23,18.26 IC1.4 | v41.27,53.82 v41.27,47.47 | v56.51,47.47 v56.51,43.66
  Bottom 0.254: IC1.4 104.77,18.26 106.04,16.99 116.2,16.99 117.47,18.26 IC13.4 | v125.09,36.04 v100.96,36.04 93.34,36.04 92.07,37.31 93.34,38.58 93.34,41.12 73.02,41.12 70.48,43.66 U$2.29 v56.51,43.66 | v125.09,52.55 IC2.7 | U$1.A17 6.98,52.55 17.14,52.55 18.41,53.82 v41.27,53.82 | v41.27,47.47 v56.51,47.47
BUSD6  (via drill 0.61)
  Top 0.254: v107.31,48.74 106.04,47.47 v106.04,24.61 106.04,22.07 104.77,20.8 IC1.3 | v40,32.23 41.27,33.5 v41.27,43.66 | v56.51,22.07 56.51,37.31 57.78,38.58 57.78,39.85 U$2.12
  Bottom 0.254: IC1.3 107.31,20.8 108.58,19.53 116.2,19.53 117.47,20.8 IC13.3 | v107.31,48.74 118.74,48.74 120.01,50.01 IC2.8 | U$1.A16 3.17,46.2 3.17,27.15 32.38,27.15 34.92,29.69 37.46,29.69 v40,32.23 | v41.27,43.66 U$2.12 | v106.04,24.61 100.96,24.61 99.69,23.34 71.75,23.34 70.48,22.07 v56.51,22.07
BUSD7  (via drill 0.61)
  Top 0.254: v116.2,46.2 116.2,41.12 118.74,41.12 118.74,29.69 117.47,28.42 | 117.47,28.42 116.2,27.15 116.2,24.61 117.47,23.34 IC13.2 | v116.2,28.42 117.47,28.42 | v64.13,47.47 64.13,37.31 65.4,36.04 v65.4,29.69
  Bottom 0.254: IC1.2 107.31,23.34 108.58,22.07 114.93,22.07 116.2,23.34 IC13.2 | v116.2,46.2 118.74,46.2 120.01,47.47 IC2.9 | U$1.A15 6.98,47.47 17.14,47.47 18.41,48.74 31.11,48.74 33.65,46.2 U$2.11 56.51,46.2 57.78,47.47 v64.13,47.47 | v116.2,28.42 100.96,28.42 99.69,27.15 73.02,27.15 70.48,29.69 v65.4,29.69
CPUA12  (via drill 0.61)
  Top 0.254: IC13.15 125.09,13.18 123.82,14.45 v123.82,16.99 v123.82,33.5 | U$2.2 55.24,70.33 55.24,77.95 57.78,80.49 60.32,80.49 60.32,63.98 61.59,62.71 v61.59,53.82 | v104.77,53.82 107.31,56.36 v107.31,65.25 | v131.44,61.44 131.44,36.04 U1.22
  Bottom 0.254: v123.82,16.99 139.06,16.99 140.33,15.72 IC5.16 | v61.59,53.82 62.86,53.82 64.13,52.55 79.37,52.55 80.64,51.28 81.91,51.28 83.18,50.01 84.45,50.01 88.26,53.82 v104.77,53.82 | v107.31,65.25 114.93,65.25 116.2,66.52 123.82,66.52 126.36,63.98 126.36,61.44 v131.44,61.44 | v123.82,33.5 130.17,33.5 131.44,34.77 U1.22
CPUA13  (via drill 0.61)
  Top 0.254: v104.77,69.06 109.85,63.98 v109.85,38.58 | v121.28,15.72 v121.28,38.58
  Bottom 0.254: IC5.5 IC13.16 v121.28,15.72 | v104.77,69.06 86.99,69.06 83.18,65.25 80.64,65.25 79.37,66.52 78.1,66.52 76.83,65.25 74.29,65.25 70.48,69.06 U$2.39 | v109.85,38.58 v121.28,38.58 131.44,38.58 U1.23
CPUA14  (via drill 0.61)
  Top 0.254: v86.99,62.71 92.07,62.71 93.34,61.44 v93.34,42.39 | v139.06,37.31 139.06,22.07 140.33,20.8 IC5.18
  Bottom 0.254: IC13.17 127.63,18.26 128.9,19.53 139.06,19.53 140.33,20.8 IC5.18 | U$2.37 70.48,63.98 74.29,60.17 79.37,60.17 80.64,58.9 83.18,58.9 v86.99,62.71 | v93.34,42.39 94.61,41.12 131.44,41.12 U1.24 136.52,39.85 v139.06,37.31
CPUA15  (via drill 0.61)
  Top 0.254: v90.8,58.9 92.07,57.63 v92.07,44.93 | v137.79,39.85 137.79,14.45 135.25,11.91 131.44,11.91 131.44,19.53 132.71,20.8 IC5.3
  Bottom 0.254: IC5.3 IC13.18 | U$2.35 70.48,58.9 73.02,56.36 79.37,56.36 80.64,55.09 81.91,55.09 83.18,53.82 84.45,53.82 84.45,55.09 88.26,58.9 v90.8,58.9 | v92.07,44.93 93.34,43.66 131.44,43.66 U1.25 135.25,42.39 v137.79,39.85
CPUD0
  Top 0.254: IC2.18 U1.33
CPUD1
  Bottom 0.254: IC2.17 U1.32
CPUD2
  Bottom 0.254: IC2.16 U1.31
CPUD3
  Bottom 0.254: IC2.15 U1.30
CPUD4
  Bottom 0.254: IC2.14 U1.29
CPUD5
  Bottom 0.254: IC2.13 U1.28
CPUD6
  Bottom 0.254: IC2.12 U1.27
CPUD7
  Bottom 0.254: IC2.11 U1.26
GND  (via drill 0.61, 0.7)
  Top 0.254: C3.2 IC4.7 144.14,69.06 144.14,58.9 | 144.14,58.9 C2.2 | C16.2 136.52,46.2 C17.2 | JP4.1 JP3.1 JP2.1 | QG1.7 156.84,39.85 155.57,41.12 155.57,50.01 C1.2 U$3.4 156.84,58.9 144.14,58.9 | IC4.12 IC4.13 155.57,81.76 | 155.57,81.76 C18.2 | 155.57,81.76 155.57,85.57 156.84,86.84 IC10.7 | 136.52,89.38 137.79,89.38 C19.2 | 136.52,89.38 132.71,89.38 IC12.7 | C20.2 113.66,90.65 v112.39,89.38 112.39,83.03 C9.2 | IC13.1 120.01,25.88 v120.01,28.42 120.01,44.93 IC2.10 | C11.2 95.88,27.15 v93.34,29.69 94.61,30.96 C12.2 94.61,61.44 89.53,66.52 | 89.53,74.14 C21.2 | 89.53,66.52 89.53,74.14 | 89.53,66.52 85.72,62.71 89.53,58.9 IC14.1 | 89.53,74.14 89.53,76.68 86.99,76.68 84.45,79.22 IC16.8 | U$1.A28 U$1.A29 U$1.A30 U$1.A31 U$1.A32 | IC3.10 19.68,62.71 18.41,63.98 18.41,77.95 17.14,79.22 17.14,80.49 18.41,81.76 18.41,84.3 19.68,85.57 IC3.1 22.22,85.57 C6.2 | C5.2 IC17.19 45.08,94.46 43.81,95.73 | C10.2 65.4,76.68 65.4,85.57 64.13,86.84 64.13,89.38 61.59,91.92 C22.2 | 43.81,95.73 43.81,97 IC17.1 | IC5.8 139.06,8.1 | 139.06,8.1 IC5.13 | 139.06,8.1 139.06,11.91 140.33,13.18 IC5.15 142.87,13.18 144.14,14.45 144.14,15.72 146.68,18.26 146.68,23.34 C15.2 144.14,25.88 144.14,39.85 v141.6,42.39 | 92.07,3.02 IC6.8 | 92.07,3.02 IC6.9 IC6.10 | C7.2 33.65,51.28 33.65,46.2 31.11,43.66 31.11,41.12 36.19,41.12 | 36.19,41.12 36.19,38.58 34.92,37.31 JP6.1 | 40,55.09 40,53.82 38.73,52.55 38.73,43.66 36.19,41.12 | 40,55.09 40,57.63 38.73,58.9 IC17.10 37.46,74.14 36.19,75.41 36.19,77.95 34.92,79.22 34.92,80.49 v32.38,84.3 33.65,84.3 37.46,88.11 41.27,88.11 42.54,89.38 42.54,94.46 43.81,95.73 | v20.95,10.64 20.95,6.83 24.76,3.02 IC18.10
  Top 0.254: 15.87,10.64 C23.- | U$1.C1 15.87,10.64 | C24.2 67.94,22.07 U$2.21 | C4.2 45.08,29.69 43.81,30.96 43.81,32.23 42.54,33.5 | 42.54,33.5 38.73,29.69 38.73,24.61 C8.2 | IC15.10 23.49,32.23 26.03,29.69 IC18.1 | 15.87,10.64 15.87,14.45 17.14,15.72 17.14,27.15 18.41,28.42 18.41,30.96 v17.14,32.23 | 40,55.09 42.54,55.09 42.54,33.5 | v136.52,72.87 136.52,89.38 | IC6.2 89.53,18.26 90.8,16.99 90.8,14.45 92.07,13.18 92.07,3.02
  Bottom 0.254: C17.2 139.06,67.79 | 139.06,67.79 142.87,67.79 144.14,69.06 IC4.7 | QG1.7 156.84,29.69 155.57,29.69 JP2.1 | v112.39,89.38 108.58,89.38 IC7.7 | U1.1 116.2,81.76 C9.2 | C20.2 C19.2 153.03,93.19 156.84,89.38 IC10.7 | C14.2 v120.01,28.42 117.47,28.42 114.93,30.96 109.85,30.96 C13.2 | C11.2 99.69,24.61 100.96,25.88 IC1.1 106.04,25.88 107.31,24.61 116.2,24.61 117.47,25.88 IC13.1 | v93.34,29.69 90.8,32.23 IC14.10 | 136.52,46.2 C16.2 | 136.52,46.2 123.82,46.2 122.55,44.93 IC2.10 | U$1.A32 U$1.C32 C6.2 | C22.2 57.78,93.19 56.51,94.46 C5.2 | v32.38,84.3 26.03,84.3 24.76,85.57 IC3.1 | 131.44,4.29 121.28,4.29 120.01,3.02 IC13.10 117.47,3.02 116.2,1.75 106.04,1.75 104.77,3.02 IC1.10 IC6.9 | 131.44,4.29 132.71,3.02 IC5.10 IC5.11 | C15.2 146.68,25.88 146.68,32.23 U1.21 | U$4.3 153.03,6.83 151.76,8.1 IC5.13 | 131.44,4.29 131.44,8.1 IC5.8 | IC19.7 61.59,4.29 64.13,1.75 79.37,1.75 80.64,3.02 | 80.64,3.02 IC11.7 | IC6.8 80.64,3.02 | U$1.A1 U$1.C1 | C23.- v20.95,10.64 | U$2.21 U$2.20 C8.2 36.19,24.61 31.11,24.61 29.84,25.88 IC18.1 | v17.14,32.23 IC15.10 | C24.2 74.29,15.72 75.56,16.99 85.72,16.99 86.99,18.26 IC6.2 | 136.52,46.2 136.52,42.39 v141.6,42.39 | 139.06,67.79 139.06,70.33 v136.52,72.87
IOINH
  Top 0.254: IC5.1 135.25,25.88 135.25,80.49 130.17,85.57 121.28,85.57 121.28,90.65 118.74,93.19 118.74,98.27 103.5,98.27 IC7.10
MA12  (via drill 0.61)
  Top 0.254: v55.24,22.07 55.24,37.31 v56.51,38.58
  Bottom 0.254: v55.24,22.07 36.19,22.07 34.92,20.8 IC18.18 | v56.51,38.58 U$2.27
MA13  (via drill 0.61)
  Top 0.254: v31.11,9.37 31.11,16.99 32.38,18.26 IC18.17 | v56.51,6.83 56.51,13.18 57.78,14.45 57.78,20.8 60.32,23.34 v60.32,36.04
  Bottom 0.254: v31.11,9.37 45.08,9.37 46.35,8.1 47.62,9.37 48.89,9.37 51.43,6.83 v56.51,6.83 | v60.32,36.04 U$2.26
MA14  (via drill 0.61)
  Top 0.254: v40,28.42 40,22.07 34.92,16.99 34.92,15.72 IC18.16
  Bottom 0.254: v40,28.42 42.54,30.96 51.43,30.96 52.7,32.23 56.51,32.23 57.78,33.5 U$2.25
MA15  (via drill 0.61)
  Top 0.254: v37.46,13.18 v37.46,18.26 | v59.05,19.53 62.86,23.34 v62.86,30.96
  Bottom 0.254: v37.46,18.26 38.73,19.53 v59.05,19.53 | v62.86,30.96 U$2.24 | IC18.15 v37.46,13.18
MA16  (via drill 0.61)
  Top 0.254: v43.81,14.45 v43.81,29.69
  Bottom 0.254: v43.81,14.45 40,14.45 37.46,11.91 36.19,11.91 34.92,10.64 IC18.14 | v43.81,29.69 62.86,29.69 64.13,28.42 U$2.23
MA17  (via drill 0.61)
  Top 0.254: v36.19,16.99 36.19,9.37 34.92,8.1 IC18.13 | v53.97,16.99 53.97,20.8 52.7,22.07 v52.7,24.61
  Bottom 0.254: v36.19,16.99 v53.97,16.99 | v52.7,24.61 55.24,24.61 56.51,25.88 U$2.22
MA18  (via drill 0.61)
  Top 0.254: v41.27,24.61 41.27,22.07 40,20.8 40,10.64 34.92,5.56 IC18.12
  Bottom 0.254: v41.27,24.61 51.43,24.61 52.7,25.88 U$2.19
MA19  (via drill 0.61)
  Top 0.254: v34.92,28.42 32.38,28.42 31.11,27.15 31.11,23.34 29.84,22.07 29.84,5.56 32.38,3.02 IC18.11
  Bottom 0.254: v34.92,28.42 36.19,27.15 42.54,27.15 43.81,28.42 U$2.18
MEMSEL  (via drill 0.7)
  Top 0.254: v108.58,8.1 108.58,5.56 109.85,4.29 121.28,4.29 v123.82,6.83 | v136.52,9.37 136.52,11.91 139.06,14.45 139.06,18.26 140.33,19.53 142.87,19.53 144.14,20.8 144.14,22.07 142.87,23.34 IC5.19 | v46.35,9.37 42.54,5.56 IC19.1
  Bottom 0.254: v108.58,8.1 106.04,8.1 104.77,9.37 102.23,9.37 99.69,11.91 94.61,11.91 92.07,14.45 78.1,14.45 76.83,13.18 76.83,10.64 75.56,9.37 64.13,9.37 62.86,10.64 62.86,13.18 59.05,13.18 57.78,14.45 48.89,14.45 47.62,13.18 IC19.12 47.62,10.64 v46.35,9.37 | v123.82,6.83 128.9,6.83 131.44,9.37 v136.52,9.37
MMUMODE  (via drill 0.61, 0.7)
  Top 0.254: v71.75,41.12 73.02,39.85 73.02,34.77 74.29,33.5 74.29,19.53 v75.56,18.26 | IC11.9 v78.1,18.26
  Bottom 0.254: U$2.13 66.67,41.12 67.94,42.39 70.48,42.39 v71.75,41.12 | IC11.1 65.4,5.56 67.94,8.1 75.56,8.1 78.1,10.64 IC11.9 | v78.1,18.26 v75.56,18.26
N$1
  Bottom 0.254: IC12.2 120.01,86.84 121.28,85.57 135.25,85.57 140.33,90.65 147.95,90.65 149.22,89.38 IC10.4
N$2
  Bottom 0.254: U$3.1 140.33,56.36 C2.1
N$3  (via drill 0.61)
  Top 0.254: v85.72,8.1 85.72,11.91 86.99,13.18 IC6.4 | v83.18,8.1 81.91,9.37 81.91,20.8 80.64,22.07 80.64,33.5 79.37,34.77 v79.37,44.93 | v65.4,47.47 v61.59,51.28
  Bottom 0.254: v83.18,8.1 v85.72,8.1 | v79.37,44.93 73.02,44.93 70.48,47.47 v65.4,47.47 | v61.59,51.28 U$2.9
N$4
  Top 0.254: IC11.3 IC11.4
N$5
  Top 0.254: IC5.9 135.25,5.56 139.06,1.75 150.49,1.75 150.49,16.99 153.03,19.53 JP4.2
N$6  (via drill 0.61)
  Top 0.254: v145.41,15.72 145.41,8.1 142.87,5.56 IC5.12
  Bottom 0.254: v145.41,15.72 147.95,18.26 151.76,18.26 151.76,23.34 153.03,23.34 JP3.2
N$7  (via drill 0.61)
  Top 0.254: v151.76,10.64 151.76,15.72 154.3,18.26 154.3,27.15 JP2.2
  Bottom 0.254: IC5.14 v151.76,10.64
N$8  (via drill 0.61)
  Top 0.254: v146.68,9.37 149.22,11.91 149.22,34.77 153.03,34.77 JP1.2
  Bottom 0.254: v146.68,9.37 140.33,9.37 139.06,10.64 IC5.7
N$9
  Top 2: 20.63,-0.52 -0.37,-0.52 -0.37,20.48
N$10
  Top 2: 140.63,-0.52 161.63,-0.52 161.63,20.48
N$11
  Top 2: 20.63,101.48 -0.37,101.48 -0.37,80.48
N$12
  Top 2: 161.63,80.48 161.63,101.48 140.63,101.48
N$13
  Bottom 2: 20.63,-0.52 -0.37,-0.52 -0.37,20.48
N$14
  Bottom 2: 140.63,-0.52 161.63,-0.52 161.63,20.48
N$15
  Bottom 2: 20.63,101.48 -0.37,101.48 -0.37,80.48
N$16
  Bottom 2: 161.63,80.48 161.63,101.48 140.63,101.48
N$17
  Top 0.254: R1.1 142.87,58.9 142.87,53.82 150.49,53.82 | 150.49,53.82 151.76,53.82 U$3.2 | 150.49,53.82 150.49,41.12 156.84,34.77 156.84,13.18 U$4.1
N$19
  Top 0.254: C1.1 151.76,52.55 154.3,55.09 U$3.3
N$20  (via drill 0.61)
  Top 0.254: v79.37,6.83 79.37,1.75 62.86,1.75 v62.86,4.29 | v50.16,9.37 48.89,10.64 48.89,47.47 51.43,50.01 52.7,50.01 52.7,52.55 U$2.8
  Bottom 0.254: v79.37,6.83 83.18,10.64 IC6.5 | v62.86,4.29 59.05,8.1 51.43,8.1 v50.16,9.37
N$22
  Bottom 0.254: JP5.3 155.57,75.41 150.49,75.41 150.49,72.87 151.76,71.6 IC4.9
N$24  (via drill 0.61)
  Top 0.254: v76.83,6.83 75.56,8.1 IC11.10
  Bottom 0.254: v76.83,6.83 69.21,6.83 67.94,5.56 IC11.2
N$25  (via drill 0.61)
  Top 0.254: v40,3.02 41.27,4.29 41.27,6.83 45.08,10.64 IC19.13 | v60.32,3.02 60.32,8.1 64.13,8.1 IC11.13
  Bottom 0.254: v40,3.02 41.27,1.75 59.05,1.75 v60.32,3.02
N$26  (via drill 0.61)
  Top 0.254: v53.97,9.37 53.97,15.72 55.24,16.99 55.24,19.53 59.05,23.34 59.05,37.31 60.32,38.58 60.32,39.85 59.05,41.12 59.05,44.93 57.78,46.2 57.78,58.9 60.32,61.44 60.32,62.71 59.05,63.98 59.05,70.33 57.78,71.6 v57.78,79.22 | v86.99,77.95 88.26,81.76 88.26,97 89.53,98.27 102.23,98.27 102.23,93.19 106.04,93.19 IC7.9
  Bottom 0.254: v53.97,9.37 52.7,9.37 IC19.11 | v57.78,79.22 59.05,79.22 60.32,77.95 73.02,77.95 74.29,76.68 76.83,76.68 78.1,77.95 80.64,77.95 81.91,79.22 85.72,79.22 v86.99,77.95
N$58  (via drill 0.61, 0.7)
  Top 0.254: v108.58,62.71 108.58,38.58 109.85,37.31 109.85,28.42 108.58,27.15 108.58,24.61 109.85,23.34 IC1.19 | v97.15,62.71 95.88,61.44 90.8,66.52 v90.8,97 | IC16.11 79.37,97 80.64,98.27 85.72,98.27 v86.99,97
  Bottom 0.254: v108.58,62.71 v97.15,62.71 | v90.8,97 v86.99,97
N$64
  Top 0.254: 29.84,37.31 31.11,36.04 31.11,33.5 29.84,32.23 IC15.11 | IC15.6 22.22,42.39 27.3,37.31 IC15.13 29.84,37.31 | 29.84,37.31 32.38,39.85 JP6.2
N$65  (via drill 0.61)
  Top 0.254: v36.19,55.09 36.19,53.82 31.11,53.82 29.84,52.55 IC15.19 | v47.62,53.82 48.89,55.09 48.89,70.33 50.16,71.6 50.16,75.41 53.97,79.22 53.97,91.92 55.24,91.92 57.78,89.38 57.78,88.11 59.05,86.84 60.32,86.84 v60.32,88.11
  Bottom 0.254: v36.19,55.09 41.27,55.09 42.54,53.82 v47.62,53.82 | v60.32,88.11 62.86,88.11 64.13,89.38 66.67,89.38 IC16.1
N$66  (via drill 0.61)
  Top 0.254: v132.71,28.42 133.98,29.69 133.98,76.68 123.82,76.68 v123.82,77.95 | v86.99,81.76 85.72,83.03 85.72,93.19 84.45,94.46 IC16.9
  Bottom 0.254: v132.71,28.42 131.44,28.42 131.44,24.61 130.17,23.34 IC13.19 | v123.82,77.95 122.55,79.22 116.2,79.22 114.93,80.49 98.42,80.49 97.15,81.76 v86.99,81.76
N$68
  Top 0.254: IC16.15 69.21,97 70.48,98.27 74.29,98.27 75.56,97 75.56,94.46 76.83,93.19 IC16.5
N$69
  Top 0.254: IC6.7 86.99,5.56 85.72,4.29 85.72,1.75 81.91,1.75 81.91,8.1 79.37,10.64 79.37,14.45 80.64,15.72 80.64,20.8 79.37,22.07 79.37,33.5 78.1,34.77 78.1,51.28 79.37,52.55 79.37,65.25 78.1,66.52 78.1,79.22 76.83,80.49 76.83,81.76 78.1,83.03 78.1,93.19 76.83,94.46 IC16.12
N$72  (via drill 0.61)
  Top 0.254: v85.72,18.26 85.72,14.45 89.53,14.45 90.8,13.18 90.8,9.37 89.53,8.1 IC6.6 | v78.1,20.8 76.83,22.07 76.83,33.5 75.56,34.77 75.56,51.28 76.83,52.55 74.29,55.09 v71.75,55.09
  Bottom 0.254: v85.72,18.26 83.18,20.8 v78.1,20.8 | v71.75,55.09 70.48,56.36 70.48,57.63 60.32,57.63 59.05,56.36 U$2.7
NOEXEC  (via drill 0.61)
  Top 0.254: v50.16,32.23 50.16,22.07 51.43,20.8 51.43,9.37 50.16,8.1 48.89,8.1 48.89,6.83 50.16,5.56 IC19.4
  Bottom 0.254: v50.16,32.23 51.43,33.5 U$2.16
NOEXECERR  (via drill 0.7)
  Top 0.254: IC11.12 70.48,9.37 66.67,9.37 61.59,4.29 61.59,1.75 56.51,1.75 55.24,3.02 IC19.6 55.24,5.56 53.97,6.83 v50.16,6.83 | v42.54,32.23 42.54,18.26 41.27,16.99 v41.27,8.1
  Bottom 0.254: U$1.A10 6.98,33.5 8.25,32.23 14.6,32.23 15.87,33.5 40,33.5 41.27,32.23 v42.54,32.23 | v50.16,6.83 45.08,6.83 43.81,8.1 v41.27,8.1
NOTMAPPED  (via drill 0.61)
  Top 0.254: v33.65,29.69 v40,36.04
  Bottom 0.254: U$1.A11 4.44,34.77 4.44,29.69 v33.65,29.69 | v40,36.04 U$2.15
PHI0  (via drill 0.61)
  Top 0.254: v51.43,80.49 47.62,84.3 IC17.15 | v104.77,77.95 v108.58,74.14
  Bottom 0.254: v51.43,80.49 59.05,80.49 60.32,79.22 80.64,79.22 81.91,80.49 85.72,80.49 86.99,79.22 97.15,79.22 98.42,77.95 v104.77,77.95 | v108.58,74.14 131.44,74.14 U1.37 133.98,72.87 135.25,74.14 139.06,74.14 140.33,72.87 147.95,72.87 151.76,69.06 IC4.8
PHI1  (via drill 0.61)
  Top 0.254: v50.16,79.22 47.62,81.76 IC17.14 | v59.05,77.95 v59.05,72.87 | v114.93,71.6 116.2,74.14 U1.3
  Bottom 0.254: v50.16,79.22 56.51,79.22 57.78,77.95 v59.05,77.95 | v59.05,72.87 70.48,72.87 70.48,71.6 74.29,67.79 76.83,67.79 78.1,69.06 79.37,69.06 80.64,67.79 84.45,67.79 86.99,70.33 108.58,70.33 109.85,71.6 v114.93,71.6
PHI2  (via drill 0.61)
  Top 0.254: v139.06,80.49 139.06,84.3 141.6,86.84 IC10.1 | v79.37,81.76 80.64,81.76 86.99,75.41 v88.26,75.41 | v114.93,79.22 114.93,85.57 IC12.1 117.47,85.57 v121.28,81.76 | IC17.11 IC17.12 IC17.13
  Bottom 0.254: v139.06,80.49 136.52,77.95 U1.39 128.9,81.76 v121.28,81.76 | v79.37,81.76 51.43,81.76 48.89,79.22 IC17.13 | v88.26,75.41 106.04,75.41 107.31,76.68 113.66,76.68 114.93,77.95 v114.93,79.22
PR/-W  (via drill 0.61)
  Top 0.254: U1.34 132.71,63.98 126.36,63.98 122.55,67.79 IC2.1 120.01,67.79 120.01,81.76 v116.2,85.57 | v103.5,81.76 IC7.5
  Bottom 0.254: v103.5,81.76 99.69,81.76 98.42,83.03 51.43,83.03 48.89,80.49 IC3.18 | v116.2,85.57 104.77,85.57 103.5,86.84 IC7.5
PW/-R  (via drill 0.61)
  Top 0.254: v56.51,18.26 56.51,14.45 55.24,13.18 IC19.9 | v73.02,19.53 v73.02,28.42 | v102.23,29.69 103.5,30.96 103.5,79.22 106.04,81.76 IC7.6
  Bottom 0.254: v56.51,18.26 59.05,18.26 60.32,19.53 v73.02,19.53 | v73.02,28.42 99.69,28.42 100.96,29.69 v102.23,29.69
RDY  (via drill 0.7)
  Top 0.254: RN1.5 U1.2 | v56.51,85.57 v61.59,80.49 | v31.11,88.11 28.57,88.11 22.22,81.76 19.68,81.76 18.41,80.49 v18.41,79.22
  Bottom 0.254: RN1.5 111.12,77.95 109.85,79.22 98.42,79.22 97.15,80.49 86.99,80.49 85.72,81.76 80.64,81.76 79.37,80.49 v61.59,80.49 | v56.51,85.57 45.08,85.57 43.81,86.84 41.27,86.84 40,88.11 v31.11,88.11 | v18.41,79.22 14.6,79.22 13.33,77.95 9.52,77.95 U$1.A26
RES  (via drill 0.61)
  Top 0.254: v93.34,11.91 93.34,19.53 92.07,19.53 | 92.07,19.53 92.07,34.77 93.34,36.04 v93.34,37.31 | v100.96,38.58 IC7.4 | IC6.15 94.61,19.53 92.07,19.53
  Bottom 0.254: IC11.8 v93.34,11.91 | v93.34,37.31 94.61,38.58 v100.96,38.58
SYNC  (via drill 0.61, 0.7)
  Top 0.254: v23.49,30.96 19.68,27.15 19.68,1.75 51.43,1.75 52.7,3.02 IC19.5 | v33.65,30.96 40,37.31 v40,52.55 | v45.08,52.55 v45.08,62.71 | U1.7 114.93,65.25 v114.93,66.52 | v37.46,52.55 38.73,53.82 38.73,56.36 36.19,58.9 29.84,58.9 28.57,60.17 32.38,63.98 32.38,70.33 29.84,72.87 IC3.15
  Bottom 0.254: v23.49,30.96 v33.65,30.96 | v45.08,52.55 v40,52.55 v37.46,52.55 | v114.93,66.52 107.31,66.52 106.04,65.25 86.99,65.25 83.18,61.44 80.64,61.44 79.37,62.71 78.1,62.71 76.83,61.44 74.29,61.44 70.48,65.25 57.78,65.25 55.24,62.71 v45.08,62.71
VCC  (via drill 0.61)
  Top 0.254: 136.52,16.99 136.52,14.45 135.25,13.18 IC5.6 | 136.52,16.99 135.25,18.26 IC5.4 | 136.52,16.99 136.52,22.07 135.25,23.34 IC5.2 | 140.33,47.47 C16.1 137.79,70.33 | 140.33,47.47 141.6,47.47 QG1.14 | 140.33,47.47 140.33,38.58 | 140.33,38.58 140.33,25.88 IC5.20 142.87,25.88 144.14,24.61 144.14,23.34 145.41,22.07 145.41,20.8 142.87,18.26 IC5.17 | 153.03,93.19 154.3,94.46 IC10.9 | 153.03,93.19 IC4.14 | C19.1 IC10.14 141.6,93.19 | 141.6,91.92 144.14,89.38 IC10.2 | 141.6,93.19 141.6,91.92 | U$3.8 U$3.7 | R2.2 R1.2 137.79,70.33 | 137.79,70.33 C17.1 | 141.6,91.92 137.79,88.11 137.79,70.33 | 153.03,93.19 141.6,93.19 | C11.1 94.61,23.34 94.61,20.8 IC6.16 | IC13.20 C14.1 | IC1.20 C13.1 v111.12,58.9 113.66,61.44 113.66,62.71 | C12.1 IC14.20 | C9.1 109.85,80.49 109.85,72.87 107.31,72.87 107.31,74.14 106.04,75.41 104.77,75.41 104.77,72.87 108.58,69.06 109.85,69.06 111.12,67.79 RN1.1 113.66,67.79 113.66,62.71 | 113.66,62.71 U1.8 | C20.1 111.12,93.19 C9.1 | IC11.14 C24.1 v65.4,27.15 | 36.19,25.88 C8.1 | 36.19,25.88 IC18.20 | C4.1 IC19.14 | U$1.C2 U$1.C3 | v36.19,19.53 36.19,25.88 | U$2.40 C10.1 70.48,75.41 71.75,74.14 73.02,75.41 70.48,77.95 66.67,77.95 66.67,85.57 65.4,86.84 65.4,89.38 62.86,91.92 62.86,94.46 64.13,95.73 IC16.16 | IC17.20 C5.1 | IC15.4 IC15.3 IC15.2 | IC15.15 27.3,42.39 22.22,47.47 IC15.4 | RN3.1 18.41,11.91 C23.+ 17.14,14.45 18.41,15.72 18.41,27.15 19.68,28.42 19.68,30.96 18.41,32.23 18.41,36.04 19.68,37.31 | 19.68,37.31 17.14,39.85 17.14,44.93 19.68,47.47 IC15.4 | 19.68,37.31 IC15.8 | JP6.3 34.92,42.39 36.19,43.66 36.19,52.55 37.46,53.82 37.46,56.36 36.19,56.36 34.92,55.09 C7.1 IC15.20 27.3,55.09 26.03,56.36 26.03,66.52 24.76,67.79 24.76,83.03 27.3,85.57 IC3.20 31.11,85.57 32.38,86.84 32.38,88.11 31.11,89.38 C6.1 32.38,91.92 v32.38,97
  Top 0.254: C9.1 107.31,81.76 v107.31,77.95 | 140.33,38.58 QG1.1
  Bottom 0.254: IC5.17 IC5.4 | C15.1 144.14,27.15 142.87,25.88 IC5.20 | JP1.1 155.57,33.5 144.14,44.93 141.6,44.93 QG1.14 | IC4.14 C18.1 | C3.1 146.68,62.71 149.22,62.71 U$3.8 149.22,70.33 R1.2 | C17.1 135.25,69.06 131.44,69.06 130.17,67.79 IC2.20 | C21.1 IC7.14 93.34,97 94.61,98.27 111.12,98.27 | IC12.14 C20.1 111.12,98.27 | v111.12,58.9 C12.1 | 113.66,27.15 123.82,27.15 125.09,25.88 IC13.20 | 113.66,27.15 112.39,25.88 IC1.20 | C11.1 94.61,25.88 99.69,25.88 100.96,27.15 113.66,27.15 | 111.12,98.27 153.03,98.27 154.3,97 IC10.9 | 34.92,16.99 36.19,15.72 C4.1 | 34.92,16.99 12.06,16.99 U$1.C3 | 34.92,16.99 36.19,18.26 v36.19,19.53 | v65.4,27.15 43.81,27.15 42.54,25.88 C8.1 | IC16.16 C22.1 60.32,97 C5.1 | IC15.15 JP6.3 | IC15.4 IC15.17 | v32.38,97 33.65,98.27 43.81,98.27 45.08,97 IC17.20 | U$1.C2 C23.+ | v107.31,77.95 106.04,77.95 104.77,76.68 88.26,76.68 84.45,72.87 78.1,72.87 76.83,71.6 74.29,71.6 70.48,75.41 C10.1
WPROT
  Top 0.254: U$2.14 51.43,36.04 51.43,22.07 52.7,20.8 IC19.10
WPROTERR  (via drill 0.61, 0.7)
  Top 0.254: IC19.8 57.78,13.18 59.05,14.45 v59.05,16.99 64.13,16.99 64.13,30.96 62.86,32.23 62.86,37.31 61.59,38.58 v60.32,37.31 | v73.02,16.99 IC11.11
  Bottom 0.254: v59.05,16.99 60.32,18.26 69.21,18.26 70.48,16.99 v73.02,16.99 | U$1.A12 8.25,38.58 9.52,39.85 15.87,39.85 17.14,38.58 29.84,38.58 32.38,36.04 37.46,36.04 38.73,37.31 v60.32,37.31

## Text on the board
Top: CSACPU-V2.0G | (C) A. Fachat